# Altium schematic sheet Low_Pass_Filter_Ing_Galilee.SchDoc
size A3; SheetNumber: 1; SheetTotal: 1; SPICEModelCacheWKEEEMJP: <root> / <DocumentId>WKEEEMJP</DocumentId> / <CacheFrame Number="0"> / <Model Name="op27e" Kind="CKT"> / <Text>* OP27E SPICE Macro-model                  12/90, Rev. B / *                                           JCB / PMI / * / * Revision History: / *   REV. B / *     Re-ordered subcircuit call out nodes to put the / *     output node last. / *     Changed Ios from 35E-9 to 17.5E-9 / *     Added F1 and F2 to fix short circuit current limit. / * / * / * This version of the OP-27 model simulates the worst case / * parameters of the 'E' grade.  The worst case parameters / * used correspond to those in the data book. / * / * / * Copyright 1990 by Analog Devices, Inc. / * / * Refer to "README.DOC" file for License Statement.  Use of this model / * indicates your acceptance with the terms and provisions in the License Statement. / * / * Node assignments / *              non-inverting input / *              |   inverting input / *              |   | positive supply / *              |   |   |   negative supply / *              |   |   |   |   output / *              |   |   |   |   | / .SUBCKT OP27E  1   2   99  50  39 / * / * INPUT STAGE &amp; POLE AT 80 MHZ / * / R3   5  97    0.0619 / R4   6  97    0.0619 / CIN  1   2    4E-12 / C2   5   6    16.07E-9 / I1   4  51    1 / IOS  1   2    17.5E-9 / EOS  9  10    POLY(1)  30 33  25E-6  1 / Q1   5  2  7  QX / Q2   6  9  8  QX / R5   7   4    0.0107 / R6   8   4    0.0107 / D1   2   1    DX / D2   1   2    DX / EN   10  1    12  0  1 / GN1  0   2    15  0  1 / GN2  0   1    18  0  1 / * / EREF  98 0    33  0  1 / EPLUS 97 0    99  0  1 / ENEG  51 0    50  0  1 / * / * VOLTAGE NOISE SOURCE WITH FLICKER NOISE / * / DN1  11  12   DEN / DN2  12  13   DEN / VN1  11   0   DC 2 / VN2  0   13   DC 2 / * / * CURRENT NOISE SOURCE WITH FLICKER NOISE / * / DN3  14  15   DIN / DN4  15  16   DIN / VN3  14   0   DC 2 / VN4  0   16   DC 2 / * / * SECOND CURRENT NOISE SOURCE / * / DN5  17  18    DIN / DN6  18  19    DIN / VN5  17   0    DC 2 / VN6  0   19    DC 2 / * / * FIRST GAIN STAGE / * / RG1  40 98     1 / GG1  98 40     5  6  79.86 / DG3  40 41     DX / DG4  42 40     DX / EG1  97 41     POLY(1)  97  33  -2.1  1 / EG2  42 51     POLY(1)  97  33  -2.1  1 / * / * GAIN STAGE &amp; DOMINANT POLE AT 7.2 HZ / * / R7   20 98     37.58E3 / C3   20 98     588E-9 / G1   98 20     40  33  0.333 / V1   97 21     1.9 / V2   22 51     1.9 / D5   20 21     DX / D6   22 20     DX / * / * POLE - ZERO AT 2.9MHZ / 6MHZ / * / R8   23 98     1 / R9   23 24     0.935 / C4   24 98     28.4E-9 / G2   98 23     20 33  1 / * / * ZERO - POLE AT 6.8MHZ / 40MHZ / * / R10  25 26     1 / R11  26 98     4.88 / L1   26 98     19.4E-9 / G3   98 25     23 33  1 / * / * POLE AT 60 MHZ / * / R12  27 98     1 / C5   27 98     2.65E-9 / G4   98 27     25 33 1 / * / * ZERO AT 28 MHZ / * / R13  28 29     1 / C6   28 29     -5.68E-9 / R14  29 98     1E-6 / E1   28 98     27 33  1E6 / * / * COMMON-MODE GAIN NETWORK WITH ZERO AT 11.9 KHZ / * / R15  30 31     1 / L2   31 98     13.3E-6 / G5   98 30     POLY(2) 1  33  2  33  0  997.6E-9  997.6E-9 / D7   30 97     DX / D8   51 30     DX / * / * POLE AT 80 MHZ / * / R16  32 98     1 / C7   32 98     1.99E-9 / G6   98 32     29 33  1 / * / * OUTPUT STAGE / * / R17  33 97     1 / R18  33 51     1 / GSY  99 50     POLY(1) 99 50 3.47E-3 40E-6 / F1   34  0     V3  1 / F2   0  34     V4  1 / R19  34 99     180 / R20  34 50     180 / L3   34 39     1E-7 / G7   37 50     32 34  5.56E-3 / G8   38 50     34 32  5.56E-3 / G9   34 99     99 32  5.56E-3 / G10  50 34     32 50  5.56E-3 / V3   35 34     2.5 / V4   34 36     3.1 / D9   32 35     DX / D10  36 32     DX / D11  99 37     DX / D12  99 38     DX / D13  50 37     DY / D14  50 38     DY / * / * MODELS USED / * / .MODEL QX NPN(BF=12.5E6) / .MODEL DX   D(IS=1E-15) / .MODEL DY   D(IS=1E-15 BV=50) / .MODEL DEN  D(IS=1E-12, RS=1.74K, KF=4.01E-16, AF=1) / .MODEL DIN  D(IS=1E-12, RS=43.5E-6, KF=11.1E-15, AF=1) / .ENDS</Text> / </Model> / </CacheFrame> / </root>
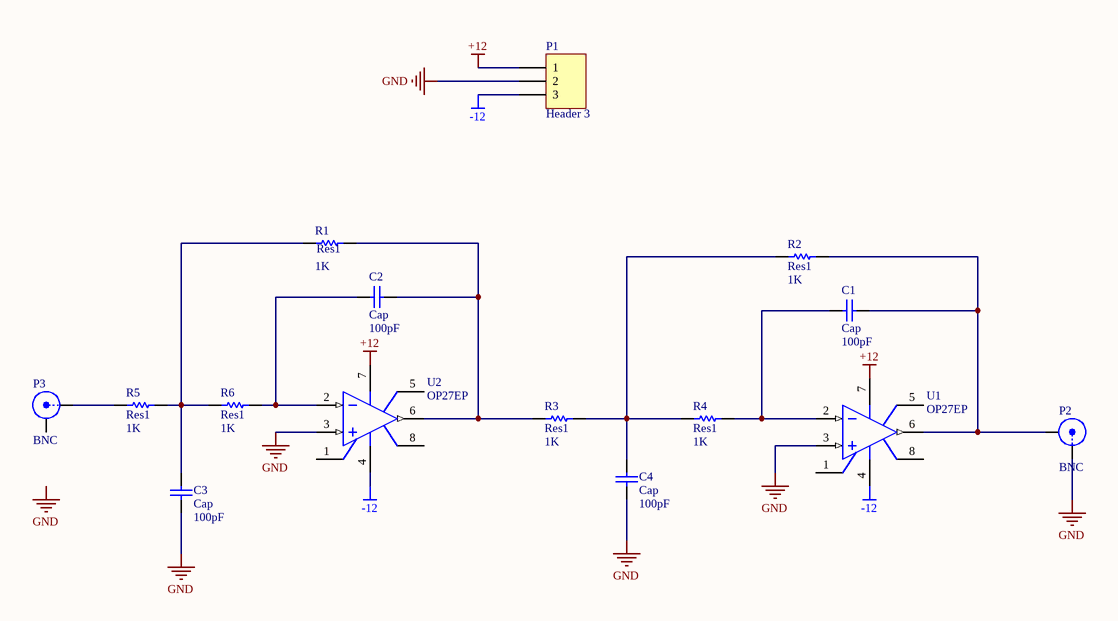
[diagram p0: Low_Pass_Filter_Ing_Galilee.SchDoc]

## Parts
C1  Cap  value 100pF  [RAD-0.3]
C2  Cap  value 100pF  [RAD-0.3]
C3  Cap  value 100pF  [RAD-0.3]
C4  Cap  value 100pF  [RAD-0.3]
P1  Header 3  [HDR1X3]
P2  BNC  [BNC_RA CON]
P3  BNC  [BNC_RA CON]
R1  Res1  value 1K  [AXIAL-0.3]
R2  Res1  value 1K  [AXIAL-0.3]
R3  Res1  value 1K  [AXIAL-0.3]
R4  Res1  value 1K  [AXIAL-0.3]
R5  Res1  value 1K  [AXIAL-0.3]
R6  Res1  value 1K  [AXIAL-0.3]
U1  OP27EP  [N-8_A]
U2  OP27EP  [N-8_A]

## Nets
+12: P1.1 U1.7(V+) U2.7(V+)
-12: P1.3 U1.4(V-) U2.4(V-)
GND: C3.1 C4.1 P1.2 P2.1(X) U1.3(IN+) U2.3(IN+)
NetC1_1: C1.1 P2.2(Y) R2.2 U1.6(OUT)
NetC1_2: C1.2 R4.2 U1.2(IN-)
NetC2_1: C2.1 R1.2 R3.1 U2.6(OUT)
NetC2_2: C2.2 R6.2 U2.2(IN-)
NetC3_2: C3.2 R1.1 R5.2 R6.1
NetC4_2: C4.2 R2.1 R3.2 R4.1
NetP3_1: P3.1(X) R5.1

Not connected (* = marked no-connect by the designer): P3 2(Y); U1 1(CMPEN) 5(NC) 8(CMPEN); U2 1(CMPEN) 5(NC) 8(CMPEN)

## Notes on the sheet
- Labels drawn without touching a wire or pin: GND

## Library data of the parts
C1-C4 = Cap: Capacitor; Published: 8-Jun-2000; LatestRevisionDate: 17-Jul-2002; LatestRevisionNote: Re-released for DXP Platform.; PackageReference: RAD-0.3; Publisher: Altium Limited; PackageDescription: Radial Cap, Thru-Hole; 2 Leads; 0.3 in Pin Spacing
P1 = Header 3: Header, 3-Pin; LatestRevisionDate: 17-Jul-2002; LatestRevisionNote: Re-released for DXP Platform.; Publisher: Altium Limited
P2 P3 = BNC: BNC Elbow Connector; LatestRevisionDate: 17-Jul-2002; LatestRevisionNote: Re-released for DXP Platform.; Publisher: Altium Limited
R1-R6 = Res1: Resistor; Published: 8-Jun-2000; LatestRevisionDate: 17-Jul-2002; LatestRevisionNote: Re-released for DXP Platform.; PackageReference: AXIAL-0.3; Publisher: Altium Limited; PackageDescription: Axial Device, Thru-Hole; 2 Leads; 0.3 in Pin Spacing
U1 U2 = OP27EP: Low-Noise, Precision Operational Amplifier; Note: Pin 5 is not connected.; Published: 8-Jun-2000; LatestRevisionDate: 04-Mar-2005; LatestRevisionNote: Stylized 3D Model Added.; DatasheetVersion: 1992; PackageReference: N-8_A; Publisher: Altium Limited; PackageDescription: DIP; 8 Leads; Row Spacing 7.62 mm; Pitch 2.54 mm; Code_JEDEC: MO-001-AN; ComponentLink1Description: Manufacturer Link; ComponentLink1URL: http://www.analog.com/en/prod/0,,759_786_OP27%2C00.html; ComponentLink2Description: Datasheet; ComponentLink2URL: http://www.analog.com/UploadedFiles/Data_Sheets/314538596OP27_c.pdf